# EAGLE design Swagelock controllerV2 (EAGLE 7.6.0)

## Sheet 1 of 2
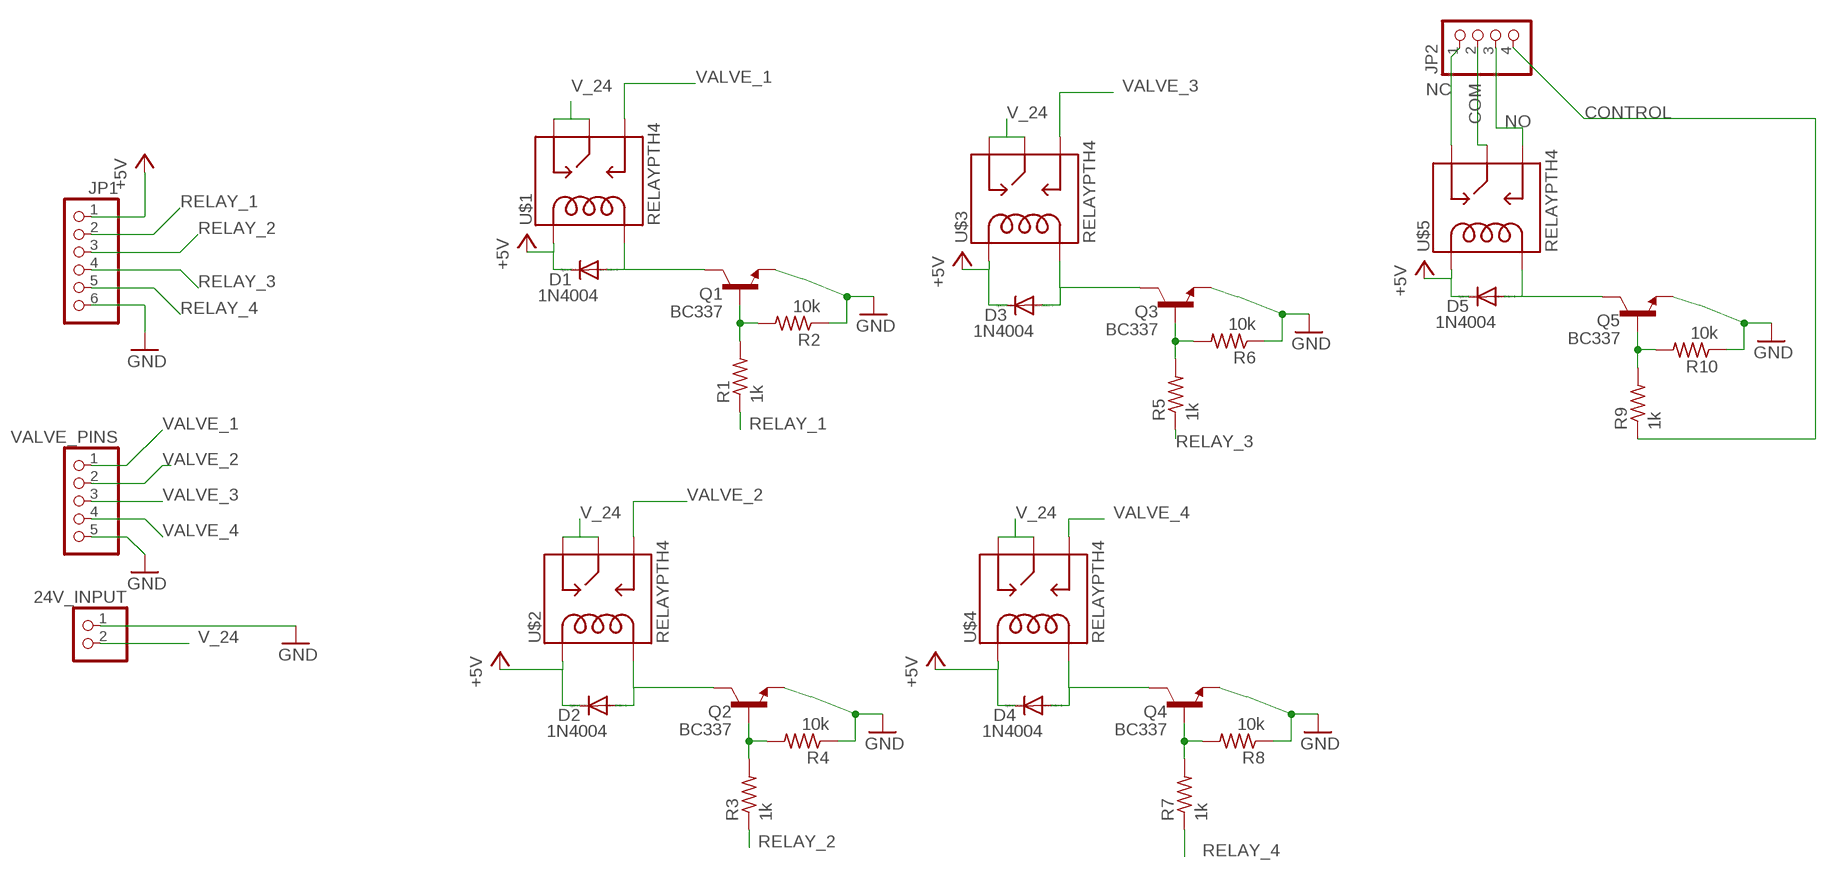
[diagram p0: schematic, sheet 1]

### Parts
24V_INPUT  PINHD-1X2  [1X02]
D1  1N4004  [DO41-10]
D2  1N4004  [DO41-10]
D3  1N4004  [DO41-10]
D4  1N4004  [DO41-10]
D5  1N4004  [DO41-10]
JP1  PINHD-1X6  [1X06]
JP2  PINHD-1X4  [1X04]
Q1  BC337  [TO92]
Q2  BC337  [TO92]
Q3  BC337  [TO92]
Q4  BC337  [TO92]
Q5  BC337  [TO92]
R1  1k  R-US_0204/5  [0204/5]
R2  10k  R-US_0204/5  [0204/5]
R3  1k  R-US_0204/5  [0204/5]
R4  10k  R-US_0204/5  [0204/5]
R5  1k  R-US_0204/5  [0204/5]
R6  10k  R-US_0204/5  [0204/5]
R7  1k  R-US_0204/5  [0204/5]
R8  10k  R-US_0204/5  [0204/5]
R9  1k  R-US_0204/5  [0204/5]
R10  10k  R-US_0204/5  [0204/5]
U$1  RELAYPTH4  [RELAY-JZC]
U$2  RELAYPTH4  [RELAY-JZC]
U$3  RELAYPTH4  [RELAY-JZC]
U$4  RELAYPTH4  [RELAY-JZC]
U$5  RELAYPTH4  [RELAY-JZC]
VALVE_PINS  PINHD-1X5  [1X05]

### Nets
+5V: D1.C D2.C D3.C D4.C D5.C JP1.1 U$1.5(COIL1) U$2.5(COIL1) U$3.5(COIL1) U$4.5(COIL1) U$5.5(COIL1)
COM: JP2.2 U$5.4(MAIN)
CONTROL: JP2.4 R9.1
GND: 24V_INPUT.1 JP1.6 Q1.1(E) Q2.1(E) Q3.1(E) Q4.1(E) Q5.1(E) R2.1 R4.1 R6.1 R8.1 R10.1 VALVE_PINS.5
N$1: Q1.2(B) R1.2 R2.2
N$2: D1.A Q1.3(C) U$1.1(COIL2)
N$3: Q2.2(B) R3.2 R4.2
N$4: D2.A Q2.3(C) U$2.1(COIL2)
N$5: Q3.2(B) R5.2 R6.2
N$6: D3.A Q3.3(C) U$3.1(COIL2)
N$7: Q4.2(B) R7.2 R8.2
N$8: D4.A Q4.3(C) U$4.1(COIL2)
N$9: Q5.2(B) R9.2 R10.2
N$10: D5.A Q5.3(C) U$5.1(COIL2)
NC: JP2.1 U$5.2(NC)
NO: JP2.3 U$5.3(NO)
RELAY_1: JP1.2 R1.1
RELAY_2: JP1.3 R3.1
RELAY_3: JP1.4 R5.1
RELAY_4: JP1.5 R7.1
V_24: 24V_INPUT.2 U$1.2(NC) U$1.4(MAIN) U$2.2(NC) U$2.4(MAIN) U$3.2(NC) U$3.4(MAIN) U$4.2(NC) U$4.4(MAIN)
VALVE_1: U$1.3(NO) VALVE_PINS.1
VALVE_2: U$2.3(NO) VALVE_PINS.2
VALVE_3: U$3.3(NO) VALVE_PINS.3
VALVE_4: U$4.3(NO) VALVE_PINS.4

## Sheet 2 of 2

## Library data of the parts
24V_INPUT = pinhead:PINHD-1X2: PIN HEADER
D1-D5 = diode:1N4004: DIODE general purpose rectifier, 1 A
JP1 = pinhead:PINHD-1X6: PIN HEADER
JP2 = pinhead:PINHD-1X4: PIN HEADER
Q1-Q5 = transistor-npn:BC337*: NPN Transistor
R1-R10 = resistor:R-US_: RESISTOR, American symbol
U$1-U$5 = SparkFun-Electromechanical:RELAY: SPDT relay (COM-00101)
VALVE_PINS = pinhead:PINHD-1X5: PIN HEADER

## Board
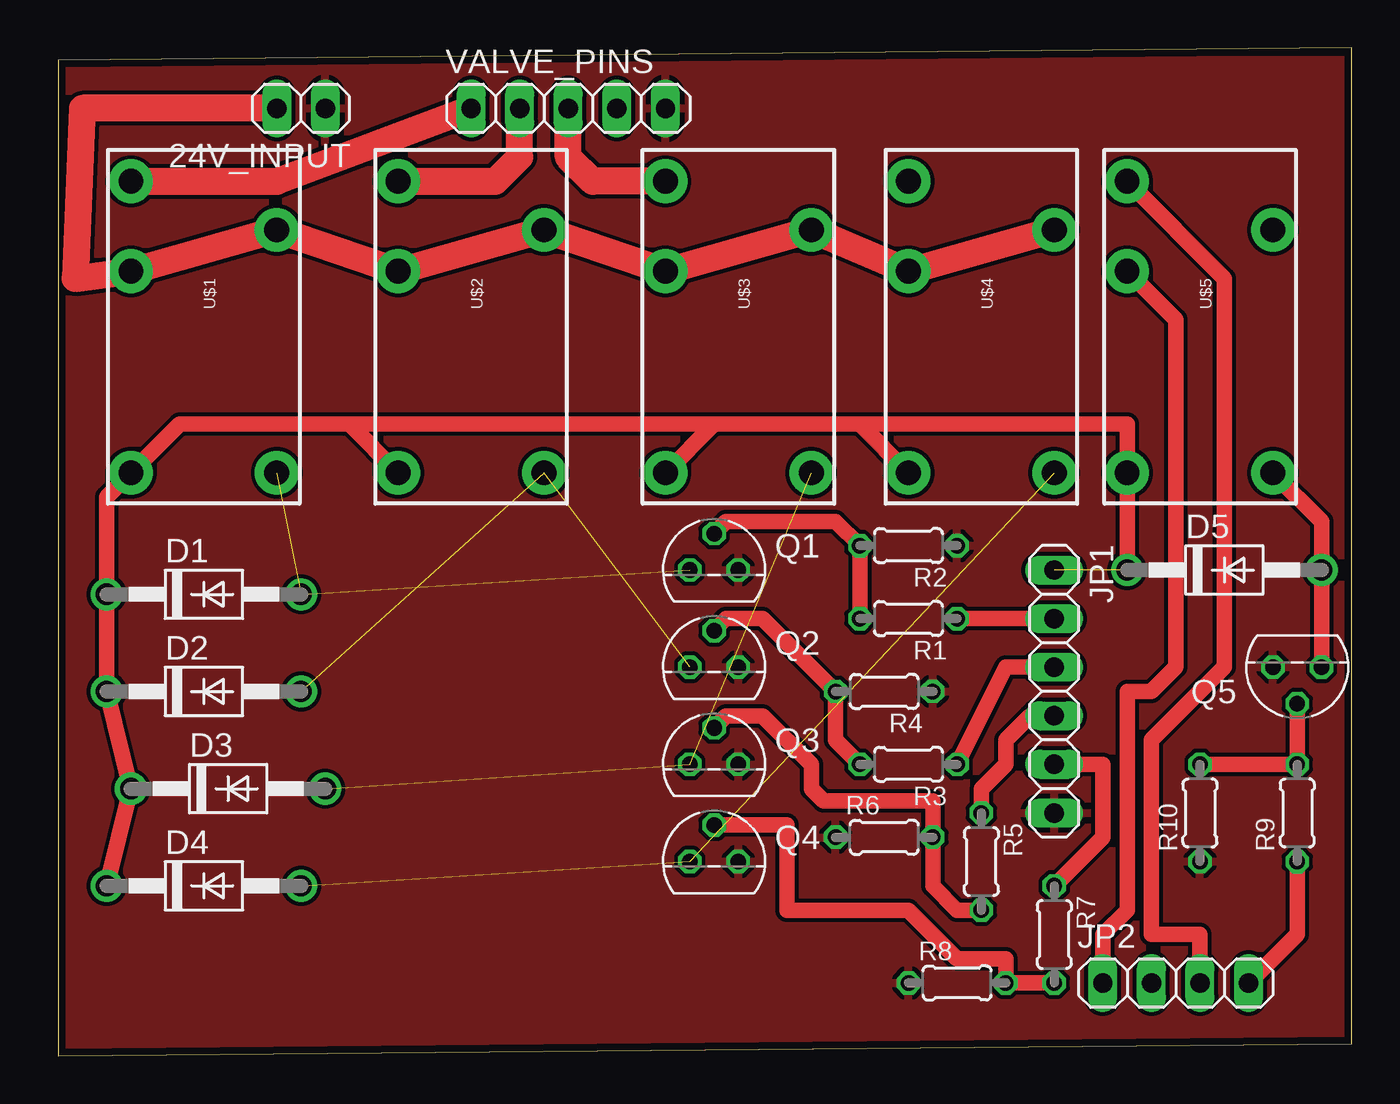
[diagram p1: board, top side]
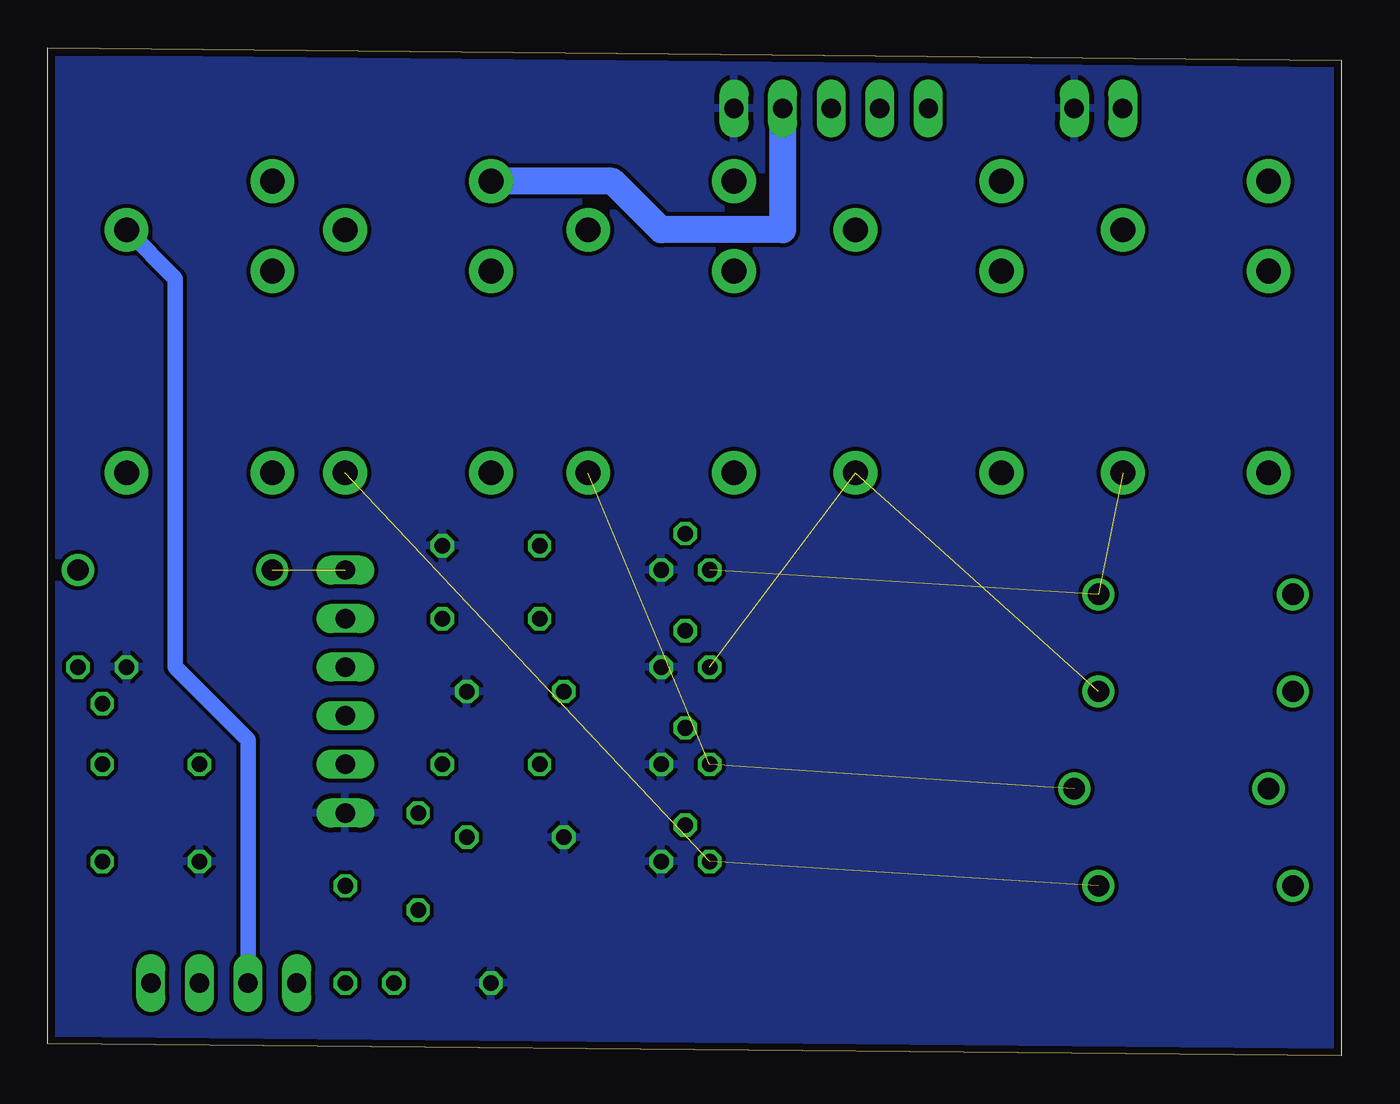
[diagram p2: board, bottom side, seen from below]

Size 67.61 x 52.7 mm. Coordinates in mm from the lower left corner, seen from the top.
Outline: 0,0 67.61,0.63 67.61,52.7 0,52.06 0,0
Copper layers (1*16): Top 0.0178mm / dielectric 59mil / Bottom 0.0178mm
Design rules "epl-lpkf": minimum track width 8mil, minimum drill 0.35mm, track to track 8mil, track to pad 8mil, pad to pad 8mil, via to via 8mil, smd to smd 8mil, copper to edge 15mil, drill to drill 15mil, minimum pad ring 8mil, minimum via ring 8mil, stop-mask expansion 3mil, vias tented up to drill 0mil, thermal gap 10mil

### Footprints (pad centres in the part's own frame; a part is rotated, then mirrored left to right if it is on the bottom)
1X02 = drill 1.016 long: 1 -1.27,0; 2 1.27,0
DO41-10 = drill 1.118: A 5.08,0; C -5.08,0
1X06 = drill 1.016 long: 1 -6.35,0; 2 -3.81,0; 3 -1.27,0; 4 1.27,0; 5 3.81,0; 6 6.35,0
1X04 = drill 1.016 long: 1 -3.81,0; 2 -1.27,0; 3 1.27,0; 4 3.81,0
TO92 = drill 0.813 octagon: 1 1.27,0; 2 0,1.905; 3 -1.27,0
0204/5 = drill 0.813 octagon: 1 -2.54,0; 2 2.54,0
RELAY-JZC = drill 1.3 pad 2.286: 1 3.81,-8.89; 2 -3.81,1.651; 3 -3.81,6.35; 4 3.81,3.81; 5 -3.81,-8.89
1X05 = drill 1.016 long: 1 -5.08,0; 2 -2.54,0; 3 0,0; 4 2.54,0; 5 5.08,0

### Placement (x,y rotation side)
24V_INPUT  12.7,49.53 180 top
D1  7.62,24.13 0 top
D2  7.62,19.05 0 top
D3  8.89,13.97 0 top
D4  7.62,8.89 0 top
D5  60.96,25.4 0 top
JP1  52.07,19.05 270 top
JP2  58.42,3.81 0 top
Q1  34.29,25.4 0 top
Q2  34.29,20.32 0 top
Q3  34.29,15.24 0 top
Q4  34.29,10.16 0 top
Q5  64.77,20.32 180 top
R1  44.45,22.86 180 top
R2  44.45,26.67 180 top
R3  44.45,15.24 180 top
R4  43.18,19.05 180 top
R5  48.26,10.16 270 top
R6  43.18,11.43 0 top
R7  52.07,6.35 270 top
R8  46.99,3.81 0 top
R9  64.77,12.7 90 top
R10  59.69,12.7 90 top
U$1  7.62,39.37 0 top
U$2  21.59,39.37 0 top
U$3  35.56,39.37 0 top
U$4  48.26,39.37 0 top
U$5  59.69,39.37 0 top
VALVE_PINS  26.67,49.53 0 top

### Tracks (layer width: path | path; a pad name or v marks a point on that pad's centre or on a via)
+5V  (1 unrouted)
  Top 0.813: D4.C D3.C D2.C D1.C 2.54,29.21 U$1.5 6.35,33.02 15.24,33.02 | 15.24,33.02 34.29,33.02 | 34.29,33.02 41.91,33.02 | 41.91,33.02 U$4.5 | U$2.5 15.24,33.02 | U$3.5 34.29,33.02 | 41.91,33.02 55.88,33.02 U$5.5 D5.C
COM
  Bottom 0.813: U$5.4 60.96,40.64 60.96,20.32 57.15,16.51 JP2.2
CONTROL
  Top 0.813: R9.1 64.77,6.35 JP2.4
GND
  pour Top: 0,52.07 69.85,52.07 69.85,0 0,0
  pour Bottom: 0,52.07 0,0 67.31,0 67.31,52.07
N$1
  Top 0.813: R1.2 R2.2 40.64,27.94 34.92,27.94 Q1.2
N$2  (2 unrouted)
N$3
  Top 0.813: R3.2 40.64,16.51 R4.2 36.83,22.86 34.92,22.86 Q2.2
N$4  (2 unrouted)
N$5
  Top 0.813: R5.2 46.99,7.62 45.72,8.89 R6.2 45.72,13.34 40.01,13.34 39.37,13.97 39.37,15.24 36.83,17.78 34.92,17.78 Q3.2
N$6  (2 unrouted)
N$7
  Top 0.813: R7.2 R8.2 49.53,5.08 46.99,5.08 44.45,7.62 38.1,7.62 38.1,12.07 Q4.2
N$8  (2 unrouted)
N$9
  Top 0.813: Q5.2 R9.2 R10.2
N$10
  Top 0.813: Q5.3 D5.A 66.04,27.94 U$5.1
NC
  Top 0.813: U$5.2 58.42,38.48 58.42,20.32 57.15,19.05 55.88,19.05 55.88,7.62 54.61,6.35 JP2.1
NO
  Top 0.813: U$5.3 60.96,40.64 60.96,20.32 57.15,16.51 57.15,6.35 59.69,6.35 JP2.3
RELAY_1
  Top 0.813: R1.1 JP1.2
RELAY_2
  Top 0.813: R3.1 49.53,20.32 JP1.3
RELAY_3
  Top 0.813: JP1.4 50.8,17.78 49.53,16.51 49.53,15.24 48.26,13.97 R5.1
RELAY_4
  Top 0.813: R7.1 54.61,11.43 54.61,15.24 JP1.5
V_24
  Top 1.422: U$4.4 U$4.2 U$3.4 U$3.2 U$2.4 U$2.2 U$1.4 U$1.2 0.89,40.64 1.27,49.53 24V_INPUT.2
VALVE_1
  Top 1.422: U$1.3 11.43,45.72 VALVE_PINS.1
VALVE_2
  Top 1.422: U$2.3 22.86,45.72 24.13,46.99 VALVE_PINS.2
VALVE_3
  Top 1.422: U$3.3 27.94,45.72 26.67,46.99 VALVE_PINS.3
VALVE_4
  Bottom 1.422: VALVE_PINS.4 29.21,43.18 35.56,43.18 38.1,45.72 U$4.3